# Altium project STM32F103.PrjPcb
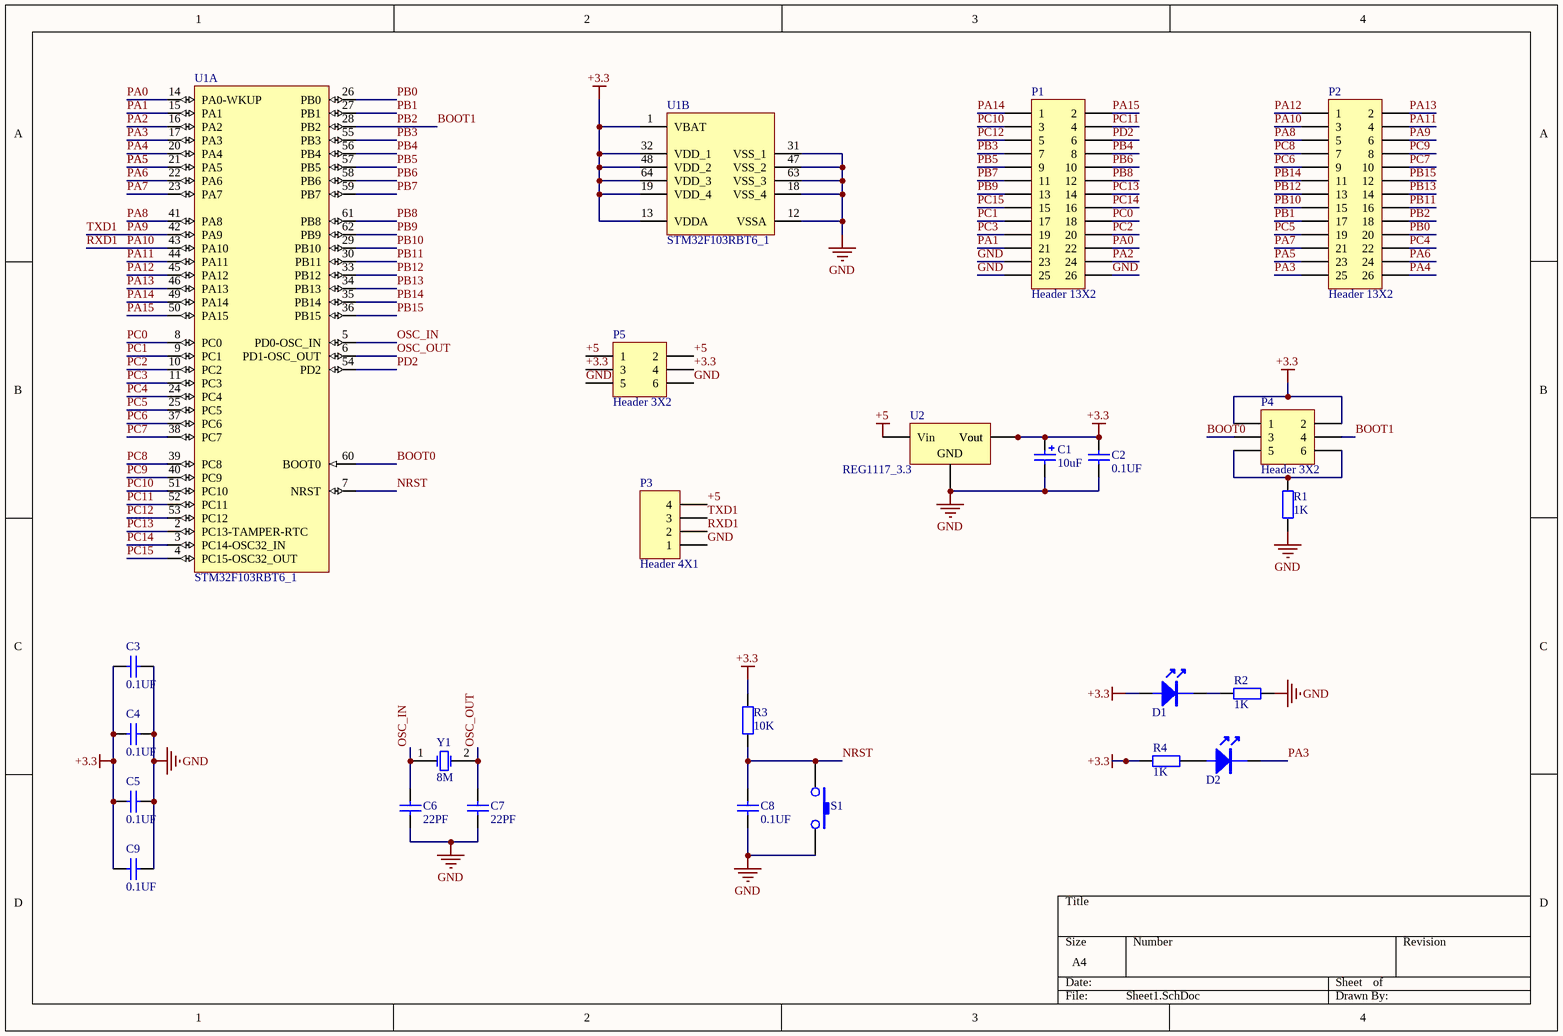
[diagram p0: Sheet1.SchDoc]
1 sheet, 24 parts. Net scope: global (net labels, ports and power ports of the same name join across sheets).
Board file: PCB1.PcbDoc

## Sheet Sheet1.SchDoc
size A4

### Parts
C1  10uF  [0805C]
C2  0.1UF  [0805C]
C3  0.1UF  [0805C]
C4  0.1UF  [0805C]
C5  0.1UF  [0805C]
C6  22PF  [0805C]
C7  22PF  [0805C]
C8  0.1UF  [0805C]
C9  0.1UF  [0805C]
D1  LED  [LED0805]  (value not drawn)
D2  LED  [LED0805]  (value not drawn)
P1  Header 13X2  [HDR2X13]
P2  Header 13X2  [HDR2X13]
P3  Header 4X1  [HDR1X4]
P4  Header 3X2  [HDR2X3]
P5  Header 3X2  [HDR2X3]
R1  1K  [0805R]
R2  1K  [0805R]
R3  10K  [0805R]
R4  1K  [0805R]
S1  KEY  [KEY_SOP_3X6X2.2MM]  (value not drawn)
U1  STM32F103RBT6_1  [STM-LQFP64_N]  (parts A,B of 2)
U2  REG1117_3.3  [SOT223_N]
Y1  8M  [OSC2PR-1]

### Nets
+3.3: C1.1 C2.2 C3.2 C4.2 C5.2 C9.2 D1.1 P4.1 P4.2 P5.3 P5.4 R3.2 R4.1 U1.1(VBAT) U1.13(VDDA) U1.19(VDD_4) U1.32(VDD_1) U1.48(VDD_2) U1.64(VDD_3) U2.3(Vout) U2.4(Vout)
+5: P3.4 P5.1 P5.2 U2.1(Vin)
GND: C1.2 C2.1 C3.1 C4.1 C5.1 C6.2 C7.2 C8.2 C9.1 P1.23 P1.25 P1.26 P3.1 P5.5 P5.6 R1.1 R2.2 S1.2 U1.12(VSSA) U1.18(VSS_4) U1.31(VSS_1) U1.47(VSS_2) U1.63(VSS_3) U2.2(GND)
BOOT0: P4.3 U1.60(BOOT0)
BOOT1: P2.18 P4.4 U1.28(PB2)  [also labelled PB2]
NRST: C8.1 R3.1 S1.1 U1.7(NRST)
OSC_IN: C6.1 U1.5(PD0-OSC_IN) Y1.1(OSC1)
OSC_OUT: C7.1 U1.6(PD1-OSC_OUT) Y1.2(OSC2)
PA0: P1.22 U1.14(PA0-WKUP)
PA1: P1.21 U1.15(PA1)
PA2: P1.24 U1.16(PA2)
PA3: D2.2 P2.25 U1.17(PA3)
PA4: P2.26 U1.20(PA4)
PA5: P2.23 U1.21(PA5)
PA6: P2.24 U1.22(PA6)
PA7: P2.21 U1.23(PA7)
PA8: P2.5 U1.41(PA8)
PA9: P2.6 P3.3 U1.42(PA9)  [also labelled TXD1]
PA10: P2.3 P3.2 U1.43(PA10)  [also labelled RXD1]
PA11: P2.4 U1.44(PA11)
PA12: P2.1 U1.45(PA12)
PA13: P2.2 U1.46(PA13)
PA14: P1.1 U1.49(PA14)
PA15: P1.2 U1.50(PA15)
PB0: P2.20 U1.26(PB0)
PB1: P2.17 U1.27(PB1)
PB3: P1.7 U1.55(PB3)
PB4: P1.8 U1.56(PB4)
PB5: P1.9 U1.57(PB5)
PB6: P1.10 U1.58(PB6)
PB7: P1.11 U1.59(PB7)
PB8: P1.12 U1.61(PB8)
PB9: P1.13 U1.62(PB9)
PB10: P2.15 U1.29(PB10)
PB11: P2.16 U1.30(PB11)
PB12: P2.13 U1.33(PB12)
PB13: P2.14 U1.34(PB13)
PB14: P2.11 U1.35(PB14)
PB15: P2.12 U1.36(PB15)
PC0: P1.18 U1.8(PC0)
PC1: P1.17 U1.9(PC1)
PC2: P1.20 U1.10(PC2)
PC3: P1.19 U1.11(PC3)
PC4: P2.22 U1.24(PC4)
PC5: P2.19 U1.25(PC5)
PC6: P2.9 U1.37(PC6)
PC7: P2.10 U1.38(PC7)
PC8: P2.7 U1.39(PC8)
PC9: P2.8 U1.40(PC9)
PC10: P1.3 U1.51(PC10)
PC11: P1.4 U1.52(PC11)
PC12: P1.5 U1.53(PC12)
PC13: P1.14 U1.2(PC13-TAMPER-RTC)
PC14: P1.16 U1.3(PC14-OSC32_IN)
PC15: P1.15 U1.4(PC15-OSC32_OUT)
PD2: P1.6 U1.54(PD2)
NetD1_2: D1.2 R2.1
NetD2_1: D2.1 R4.2
NetP4_5: P4.5 P4.6 R1.2

### Library data of the parts
C1 = Cap Pol: Polarized Capacitor (Radial); Published: 8-Jun-2000; LatestRevisionDate: 17-Jul-2002; LatestRevisionNote: Re-released for DXP Platform.; PackageReference: RB7.6-15; Publisher: Altium Limited; Value: 10uF
C2-C9 = Cap: Capacitor; Value: 15pF; Published: 8-Jun-2000; LatestRevisionDate: 17-Jul-2002; LatestRevisionNote: Re-released for DXP Platform.; PackageReference: RAD-0.3; Publisher: Altium Limited
P1 P2 = Header 13X2: Header, 13-Pin, Dual row; LatestRevisionDate: 17-Jul-2002; LatestRevisionNote: Re-released for DXP Platform.; Publisher: Altium Limited
P3 = Header 4X1: Header, 4-Pin, Right Angle; LatestRevisionDate: 17-Jul-2002; LatestRevisionNote: Re-released for DXP Platform.; Publisher: Altium Limited
P4 P5 = Header 3X2: Header, 3-Pin, Dual row; LatestRevisionDate: 17-Jul-2002; LatestRevisionNote: Re-released for DXP Platform.; Publisher: Altium Limited
R1 R2 R4 = Res: Resistor; Published: 8-Jun-2000; LatestRevisionDate: 17-Jul-2002; LatestRevisionNote: Re-released for DXP Platform.; PackageReference: AXIAL-0.4; Publisher: Altium Limited; Value: 1K
R3 = Res: Resistor; Value: 1K; Published: 8-Jun-2000; LatestRevisionDate: 17-Jul-2002; LatestRevisionNote: Re-released for DXP Platform.; PackageReference: AXIAL-0.4; Publisher: Altium Limited
U1 = STM32F103RBT6_1: ARM Cortex-M3 32-bit MCU, 128 KB Flash, 20 KB Internal RAM, 51 I/Os, 64-pin LQFP, -40 to 85 degC, Tray; A/D Converter: 2x12-bit (16 Channel); FLASH Size (Prog) (kB): 128; I/Os (High Current): 51; Internal RAM Size (kB): 20; Operating Frequency(F) (Processor speed) (MHz): 72; Supply Voltage(Vcc) min (V): 2; DatasheetVersion: Rev. 16; PackageVersion: Rev. 4, 06/2013; PackageReference: LQFP64; PackageDescription: 64-Pin Low Profile Quad Flat Package, 10 x 10 mm Body, 0.5 mm Pitch; Supplier 1: Digi-Key; Supplier Part Number 1: 497-6066-ND; Supplier 2: Farnell; Supplier Part Number 2: 1447640; Supplier 3: Newark; Supplier Part Number 3: 59M2183; Supplier 4: Newark; Supplier Part Number 4: 57P1224; Supplier 5: Mouser; Supplier Part Number 5: 511-STM32F103RBT6; Core: ARM Cortex-M3; Packing: Tray; Mounting Technology: Surface Mount; PartNumber: STM32F103RBT6; ComponentLink1Description: Manufacturer URL; ComponentLink1URL: http://www.st.com/web/en/home.html; ComponentLink2Description: Datasheet; ComponentLink2URL: http://www.st.com/st-web-ui/static/active/en/resource/technical/document/datasheet/CD00161566.pdf; ComponentLink3Description: Package Specification; ComponentLink3URL: http://www.st.com/st-web-ui/static/active/en/resource/technical/document/datasheet/DM00037051.pdf
U2 = Vlot_Reg: pin to pad: 1>3 2>1 3>2
Y1 = XTAL: Crystal Oscillator; Published: 8-Jun-2000; LatestRevisionDate: 17-Jul-2002; LatestRevisionNote: Re-released for DXP Platform.; PackageReference: R38; Publisher: Altium Limited